# EAGLE schematic zxld381-boost-driver-24mm-driver-mk-1 (EAGLE 6.4)
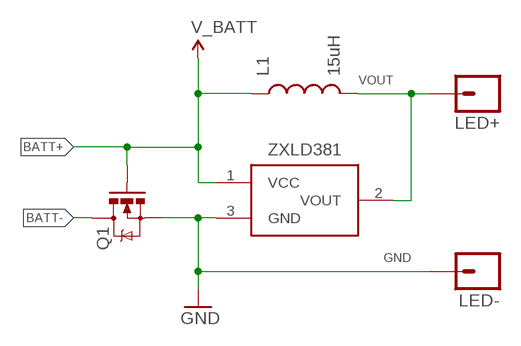
[diagram p0: schematic, sheet 1]

## Parts
L1  15uH  INDUCTOR0805  [0805]
LED+  M01PTH-1.2MM-NS  [1X01-1.2MM-NS]
LED-  M01PTH-1.2MM-NS  [1X01-1.2MM-NS]
Q1  MOSFET-NCHANNELIRLML2502  [SOT23]
ZXLD381  ZXLD381  [SOT23-3]

## Nets
BATT+: L1.1 Q1.1(G) ZXLD381.1(VCC) ; supply symbol labelled V_BATT
BATT-: Q1.3(D)
GND: LED-.P$1 Q1.2(S) ZXLD381.3(GND)
VOUT: L1.2 LED+.P$1 ZXLD381.2(VOUT)

## Library data of the parts
L1 = A_butts:INDUCTOR: Inductors Basic Inductor/Choke - 0603 and 1206. Footprints are not proven and vary greatly between part numbers. SRN6045- 33uH, 20% 1.4A SDR0403-560KL - 56uH, 10%, 500mA RMS/740mA peak
LED+ LED- = A_butts:M01: Header 1 Standard 1-pin 0.1" header. Use with straight break away headers (SKU : PRT-00116), right angle break away headers (PRT-00553), swiss pins (PRT-00743), machine pins (PRT-00117), and female headers (PRT-00115).
Q1 = A_butts:MOSFET-NCHANNEL: Common NMOSFET Parts MFG P/N Store ID Prod ID FDD8780 TRANS-09984 SI7820DN TRANS-11055 FDS6630A IC-08089 2N7002PW TRANS-11151 FQP30N06L COM-10213 TRANS-10060 BSS123LT1G TRANS-08345 BSS138 TRANS-00830 BS170 2N7000
ZXLD381 = A_butts:ZXLD381